# Altium schematic sheet 07-NCP3066_LCD背光.SchDoc
size A4; DocumentNumber: 28; SheetNumber: 28; SheetTotal: 29
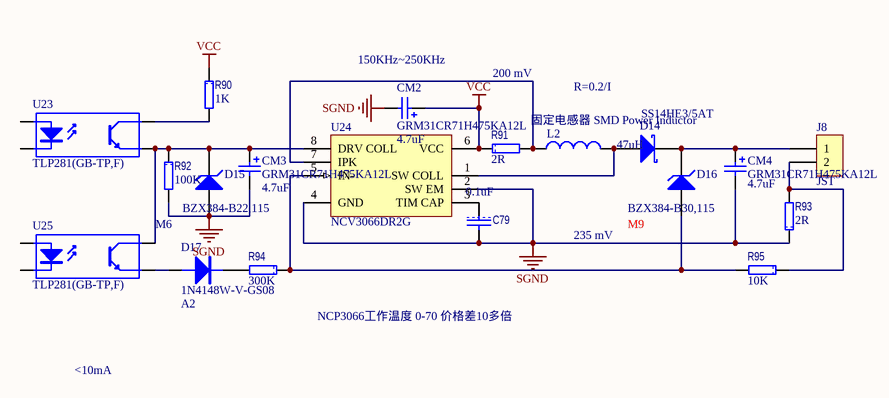
[diagram p0: 07-NCP3066_LCD背光.SchDoc]

## Parts
C79  value 0.1uF  [1608[0603]C]  (hidden comment: C1608X7R1H104K)
CM2  GRM31CR71H475KA12L  value 4.7uF  [3216[1206]C]
CM3  GRM31CR71H475KA12L  value 4.7uF  [3216[1206]C]
CM4  GRM31CR71H475KA12L  value 4.7uF  [3216[1206]C]
D14  SS14HE3/5AT  [DO-214AC/SMA]
D15  BZX384-B22,115  value M6  [SOD323]
D16  BZX384-B30,115  value M9  [SOD323]
D17  1N4148W-V-GS08  value A2  [SOD323]
J8  JST  [JST]
L2  value 47uH  [INDP5050X28N]  (hidden comment: CDRH5D28RH125NP-470MC)
R90  value 1K  [1608[0603]R]  (hidden comment: CRCW06031K00FKEA)
R91  value 2R  [1608[0603]R]  (hidden comment: CRCW06032R00FKEA)
R92  value 100K  [1608[0603]R]  (hidden comment: CRCW0603100KFKEA)
R93  value 2R  [1608[0603]R]  (hidden comment: CRCW06032R00FKEA)
R94  value 300K  [1608[0603]R]  (hidden comment: CRCW0603300KFKEA)
R95  value 10K  [1608[0603]R]  (hidden comment: CRCW060310K0FKEA)
U23  TLP281(GB-TP,F)  [SSOP4_N]
U24  NCV3066DR2G  [SOIC8_N]
U25  TLP281(GB-TP,F)  [SSOP4_N]

## Nets
SGND: C79.2 CM2.2 CM3.2 CM4.2 D15.1(A) R92.2 R93.1 U24.2(SW_EM) U24.4(GND)
VCC: CM2.1 R90.1 R91.1 U24.6(VCC)
NetC79_1: C79.1 U24.3(TIM_CAP)
NetCM3_1: CM3.1 D15.2(K) R92.1 U23.3(E) U24.8(DRV_COLL) U25.4(C)
NetCM4_1: CM4.1 D14.2(K) D16.2(K) J8.1
NetD14_1: D14.1(A) L2.2 U24.1(SW_COLL)
NetD16_1: D16.1(A) R94.1 R95.2 U24.5(IN-)
NetD17_1: D17.1(A) U25.3(E)
NetD17_2: D17.2(K) R94.2
NetJ8_2: J8.2 R93.2 R95.1
NetL2_1: L2.1 R91.2 U24.7(IPK)
NetR90_2: R90.2 U23.4(C)

Not connected (* = marked no-connect by the designer): U23 1(A) 2(K); U25 1(A) 2(K)

## Notes on the sheet
- (near CM2) 150KHz~250KHz
- 200 mV
- R=0.2/I
- 235 mV
- <10mA
- NCP3066工作温度 0-70 价格差10多倍

## Library data of the parts
C79 = CAP: 多层陶瓷电容器MLCC - SMD/SMT 0603 0.1uF 50volts X7R 10%; Manufacturer: TDK; 产品: General Type MLCCs; 产品种类: Low & Medium Capacitance SMD Ceramic Chip Capacitors; 外壳代码 - in: 0603; 外壳代码 - mm: 1608; 封装 / 箱体: 0603 (1608 metric); 封装: Reel; 尺寸: 0.8 mm W x 1.6 mm L x 0.8 mm H; 工作温度范围: - 55 C to + 125 C; 标准包装数量: 4000; 电压额定值: 50 V; 电容-nF: 100 nF; 电容-pF: 100000 pF; 系列: C; Category: 多层陶瓷电容器MLCC - SMD/SMT; ComponentLink1Description: http://www.tdk.com/pdf/general_B11.pdf; ComponentLink1URL: http://www.tdk.com/pdf/general_B11.pdf; Description 1: 多层陶瓷电容器MLCC - SMD/SMT 0603 0.1uF 50volts X7R 10%; Manufacturer Part Number: C1608X7R1H104K; Minimum Order Quantity: 1; Pricing 1: 1=0.160, 50=0.070, 100=0.036, 500=0.019, 1000=0.013, 4000=0.010, 8000=0.009, 12000=0.008, 20000=0.007 (USD); Reeling: True; RoHS - 贸泽: Y; RoHS: RoHS Compliant; Stock 1: 224604; Supplier 1: Mouser; Supplier Part Number 1: 810-C1608X7R1H104K; 制造商: TDK; 容差: 10 %; 温度系数/代码: X7R; 电容: 0.1 uF; 端接类型: SMD/SMT
CM2-CM4 = Cap Pol2: 多层陶瓷电容器MLCC - SMD/SMT 4.7uF 50Volts 10%; Manufacturer: Murata Electronics; 尺寸: 1.6 mm W x 3.2 mm L x 1.6 mm H; 工作温度范围: - 55 C to + 125 C; 封装 / 箱体: 1206 (3216 metric); 封装: Reel; 产品: General Type MLCCs; 系列: GRM; 电压额定值: 50 V; 电容-nF: 4700 nF; 外壳代码 - in: 1206; 外壳代码 - mm: 3216; 制造商: Murata; 标准包装数量: 2000; 温度系数/代码: X7R; Supplier 1: Mouser; Supplier Part Number 1: 81-GRM31CR71H475KA2L; Manufacturer Part Number: GRM31CR71H475KA12L; RoHS: RoHS Compliant; Description 1: 多层陶瓷电容器MLCC - SMD/SMT 4.7uF 50Volts 10%; Category: 多层陶瓷电容器MLCC - SMD/SMT; Stock 1: 57549; Pricing 1: 1=0.890, 10=0.561, 100=0.338, 1000=0.309, 2000=0.194, 10000=0.191, 24000=0.187, 50000=0.183 (USD); 电容: 4.7 uF; 端接类型: SMD/SMT; 容差: 10 %; RoHS - 贸泽: Y; Minimum Order Quantity: 1; Reeling: True; ComponentLink1URL: http://www.mouser.com/ds/2/281/product-244798.pdf; ComponentLink1Description: http://www.mouser.com/ds/2/281/product-244798.pdf
D14 = 10BQ060: 肖特基二极管与整流器 40 Volt 1.0 Amp 40 Amp IFSM; Manufacturer: Vishay Semiconductors; 配置: Single; 工作温度范围: - 65 C to + 125 C; 封装 / 箱体: SMA (DO-214AC); 封装: Reel; 产品: Schottky Rectifiers; 正向连续电流: 1 A; 最大浪涌电流: 40 A; 安装风格: SMD/SMT; 正向电压下降: 0.5 V; 制造商: Vishay; 最大反向漏泄电流: 200 uA; 峰值反向电压: 40 V; 标准包装数量: 7500; Supplier 1: Mouser; Supplier Part Number 1: 625-SS14HE3/5AT; Manufacturer Part Number: SS14HE3/5AT; RoHS: RoHS Compliant By Exemption; Description 1: 肖特基二极管与整流器 40 Volt 1.0 Amp 40 Amp IFSM; Category: 肖特基二极管与整流器; Stock 1: 0; Pricing 1: 1=0.160, 10=0.157, 50=0.153, 100=0.147, 750=0.126, 1500=0.105, 3000=0.081, 7500=0.069, 12000=0.066 (USD); 产品种类: Schottky Rectifiers; RoHS - 贸泽: E; Minimum Order Quantity: 1; Reeling: True; ComponentLink1URL: http://www.mouser.com/ds/2/427/ss12-100300.pdf; ComponentLink1Description: http://www.mouser.com/ds/2/427/ss12-100300.pdf
D15 = D Zener: 稳压二极管 DIODE ZENER 2 PCT; Manufacturer: NXP Semiconductors; 配置: Single; 封装 / 箱体: SC-76; 封装: Reel; 安装风格: SMD/SMT; 功率耗散: 300 mW; 正向电压下降: 1.1 V at 100 mA; 制造商: NXP; 最大工作温度: + 150 C; 最大反向漏泄电流: 0.05 uA; 最大齐纳阻抗: 55 Ohms; 最小工作温度: - 65 C; 产品种类: Diodes - Zener; 标准包装数量: 3000; 电压温度系数: 18.4 mV/k; 电压容差: 2 %; 齐纳电压: 22 V; Supplier 1: Mouser; Supplier Part Number 1: 771-BZX384-B22115; Manufacturer Part Number: BZX384-B22,115; RoHS: RoHS Compliant; Description 1: 稳压二极管 DIODE ZENER 2 PCT; Category: 稳压二极管; Stock 1: 5; Pricing 1: 1=0.290, 25=0.209, 100=0.163, 250=0.102, 500=0.087, 1000=0.059, 3000=0.052, 6000=0.045, 12000=0.039 (USD); RoHS - 贸泽: Y; Minimum Order Quantity: 1; Reeling: True; ComponentLink1URL: http://www.mouser.com/ds/2/302/BZX384_SERIES_2-80586.pdf; ComponentLink1Description: http://www.mouser.com/ds/2/302/BZX384_SERIES_2-80586.pdf
D16 = D Zener: 稳压二极管 DIODE ZENER 2 PCT; Manufacturer: NXP Semiconductors; 配置: Single; 封装 / 箱体: SC-76; 封装: Reel; 安装风格: SMD/SMT; 功率耗散: 300 mW; 齐纳电流: 200 mA; 制造商: NXP; 最大工作温度: + 150 C; 最大反向漏泄电流: 50 nA; 最大齐纳阻抗: 80 Ohms; 最小工作温度: - 65 C; 产品种类: Diodes - Zener; 标准包装数量: 3000; 电压温度系数: 26.6 mV/k; 电压容差: 2 %; 齐纳电压: 30 V; Supplier 1: Mouser; Supplier Part Number 1: 771-BZX384-B30115; Manufacturer Part Number: BZX384-B30,115; RoHS: RoHS Compliant; Description 1: 稳压二极管 DIODE ZENER 2 PCT; Category: 稳压二极管; Stock 1: 13413; Pricing 1: 1=0.260, 25=0.190, 100=0.147, 250=0.093, 500=0.079, 1000=0.054, 3000=0.047, 6000=0.041, 12000=0.035 (USD); RoHS - 贸泽: Y; Minimum Order Quantity: 1; Reeling: True; ComponentLink1URL: http://www.mouser.com/ds/2/302/BZX384_SERIES_2-80586.pdf; ComponentLink1Description: http://www.mouser.com/ds/2/302/BZX384_SERIES_2-80586.pdf
D17 = 1N4148W: 二极管 - 通用，功率，开关 100V Io/150mA; Manufacturer: Vishay Semiconductors; 配置: Single; 工作温度范围: - 65 C to + 150 C; 封装 / 箱体: SOD-123; 封装: Reel; 产品: Switching Diodes; 正向连续电流: 0.15 A; 最大浪涌电流: 0.5 A; 安装风格: SMD/SMT; 恢复时间: 4 ns; 正向电压下降: 1.2 V; 制造商: Vishay; 最大二极管电容: 4 pF; 最大工作温度: + 150 C; 最大功率耗散: 350 mW; 最大反向漏泄电流: 5 uA; 最小工作温度: - 65 C; 标准包装数量: 15000; Supplier 1: Mouser; Supplier Part Number 1: 625-1N4148W-V; Manufacturer Part Number: 1N4148W-V-GS08; RoHS: RoHS Compliant; Category: 二极管 - 通用，功率，开关; Stock 1: 404148; Pricing 1: 1=0.090, 10=0.083, 50=0.072, 100=0.068, 500=0.032, 1000=0.026, 3000=0.021, 9000=0.016, 10000=0.016, 18000=0.014 (USD); 峰值反向电压: 100 V; 产品种类: Switching Diodes; RoHS - 贸泽: Y; Minimum Order Quantity: 1; Reeling: True; ComponentLink1URL: http://www.mouser.com/ds/2/427/1n4148w--240387.pdf; ComponentLink1Description: http://www.mouser.com/ds/2/427/1n4148w--240387.pdf; Description 1: 二极管 - 通用，功率，开关 100V Io/150mA
J8 = CON2: CON
L2 = Inductor: 固定电感器 SMD Power Inductor; Manufacturer: Sumida; 尺寸: 6.2 mm W x 6.3 mm L x 3 mm H; 电感: 47 uH; 最大直流电流: 0.91 A; 最大直流电阻: 500 mOhms; 工作温度范围: - 40 C to + 125 C; 封装: Reel; 产品: SMD Power Inductors; 系列: CDRH; 屏蔽: Shielded; 端接类型: SMD/SMT; 容差: 20 %; 外壳高度: 3 mm; 外壳长度: 6.3 mm; 外壳宽度: 6.2 mm; Product Status: New Product; Supplier 1: Mouser; Supplier Part Number 1: 851-CDRH5D28RH125470; Manufacturer Part Number: CDRH5D28RH125NP-470MC; RoHS: RoHS Compliant; Description 1: 固定电感器 SMD Power Inductor; Category: 固定电感器; Stock 1: 3441; Pricing 1: 1=0.950, 10=0.920, 100=0.650, 500=0.640, 1000=0.620, 2000=0.600, 4000=0.470 (USD); 制造商: Sumida; RoHS - 贸泽: Y; Minimum Order Quantity: 1; Reeling: True; ComponentLink1URL: http://www.mouser.com/ds/2/390/CDRH5D28RH125-4194.pdf; ComponentLink1Description: http://www.mouser.com/ds/2/390/CDRH5D28RH125-4194.pdf
R90 = RES: 厚膜电阻器 - SMD 1/10watt 1.0Kohms 1%; Manufacturer: Vishay / Dale; 尺寸: 0.85 mm W x 1.55 mm L x 0.45 mm H; 工作温度范围: - 55 C to + 155 C; 封装 / 箱体: 0603 (1608 metric); 封装: Reel; 功率额定值: 100 mW; 产品: Thick Film Resistors SMD; 电阻: 1 kOhms; 系列: CRCW; 温度系数: 100 PPM / K; 端接类型: SMD/SMT; 电压额定值: 75 V; 制造商: Vishay; 产品种类: 0603 Thick Film Chip Resistors; 标准包装数量: 5000; 外壳代码 - in: 0603; 外壳代码 - mm: 1608; Supplier 1: Mouser; Supplier Part Number 1: 71-CRCW0603-1.0K-E3; Manufacturer Part Number: CRCW06031K00FKEA; RoHS: RoHS Compliant By Exemption; Category: 厚膜电阻器 - SMD; Stock 1: 276938; Pricing 1: 1=0.080, 10=0.013, 100=0.010, 1000=0.008, 5000=0.005, 25000=0.004, 50000=0.003 (USD); 容差: 1 %; RoHS - 贸泽: E; Minimum Order Quantity: 1; Reeling: True; ComponentLink1URL: http://www.mouser.com/ds/2/427/dcrcwe3-109170.pdf; ComponentLink1Description: http://www.mouser.com/ds/2/427/dcrcwe3-109170.pdf; Description 1: 厚膜电阻器 - SMD 1/10watt 1.0Kohms 1%
R91 R93 = RES: 厚膜电阻器 - SMD 1/10watt 2ohms 1%; Manufacturer: Vishay / Dale; 尺寸: 0.85 mm W x 1.55 mm L x 0.45 mm H; 工作温度范围: - 55 C to + 155 C; 封装 / 箱体: 0603 (1608 metric); 封装: Reel; 功率额定值: 100 mW; 产品: Thick Film Resistors SMD; 系列: CRCW; 温度系数: 100 PPM / K; 端接类型: SMD/SMT; 电压额定值: 75 V; 外壳代码 - in: 0603; 外壳代码 - mm: 1608; 制造商: Vishay; 产品种类: 0603 Thick Film Chip Resistors; Product Status: New at Mouser; Supplier 1: Mouser; Supplier Part Number 1: 71-CRCW06032R00FKEA; Manufacturer Part Number: CRCW06032R00FKEA; RoHS: RoHS Compliant By Exemption; Category: 厚膜电阻器 - SMD; Stock 1: 9213; Pricing 1: 1=0.080, 10=0.013, 100=0.010, 1000=0.008, 5000=0.005, 25000=0.004, 50000=0.003 (USD); 电阻: 2 Ohms; 容差: 1 %; RoHS - 贸泽: E; Minimum Order Quantity: 1; Reeling: True; ComponentLink1URL: http://www.mouser.com/ds/2/427/dcrcwe3-109170.pdf; ComponentLink1Description: http://www.mouser.com/ds/2/427/dcrcwe3-109170.pdf; Description 1: 厚膜电阻器 - SMD 1/10watt 2ohms 1%
R92 = RES: 厚膜电阻器 - SMD 1/10watt 100Kohms 1%; Manufacturer: Vishay / Dale; 尺寸: 0.85 mm W x 1.55 mm L x 0.45 mm H; 工作温度范围: - 55 C to + 155 C; 封装 / 箱体: 0603 (1608 metric); 封装: Reel; 功率额定值: 100 mW; 产品: Thick Film Resistors SMD; 系列: CRCW; 温度系数: 100 PPM / K; 端接类型: SMD/SMT; 电压额定值: 75 V; 制造商: Vishay; 产品种类: 0603 Thick Film Chip Resistors; 标准包装数量: 5000; 外壳代码 - in: 0603; 外壳代码 - mm: 1608; Supplier 1: Mouser; Supplier Part Number 1: 71-CRCW0603-100K-E3; Manufacturer Part Number: CRCW0603100KFKEA; RoHS: RoHS Compliant By Exemption; Category: 厚膜电阻器 - SMD; Stock 1: 175756; Pricing 1: 1=0.080, 10=0.013, 100=0.010, 1000=0.008, 5000=0.005, 25000=0.004, 50000=0.003 (USD); 电阻: 100 kOhms; 容差: 1 %; RoHS - 贸泽: E; Minimum Order Quantity: 1; Reeling: True; ComponentLink1URL: http://www.mouser.com/ds/2/427/dcrcwe3-109170.pdf; ComponentLink1Description: http://www.mouser.com/ds/2/427/dcrcwe3-109170.pdf; Description 1: 厚膜电阻器 - SMD 1/10watt 100Kohms 1%
R94 = RES: 厚膜电阻器 - SMD 1/10watt 300Kohms 1%; Manufacturer: Vishay / Dale; 尺寸: 0.85 mm W x 1.55 mm L x 0.45 mm H; 工作温度范围: - 55 C to + 155 C; 封装 / 箱体: 0603 (1608 metric); 封装: Reel; 功率额定值: 100 mW; 产品: Thick Film Resistors SMD; 系列: CRCW; 温度系数: 100 PPM / K; 端接类型: SMD/SMT; 电压额定值: 75 V; 外壳代码 - in: 0603; 外壳代码 - mm: 1608; 制造商: Vishay; 产品种类: 0603 Thick Film Chip Resistors; 标准包装数量: 5000; Supplier 1: Mouser; Supplier Part Number 1: 71-CRCW0603-300K-E3; Manufacturer Part Number: CRCW0603300KFKEA; RoHS: RoHS Compliant By Exemption; Category: 厚膜电阻器 - SMD; Stock 1: 19604; Pricing 1: 1=0.080, 10=0.013, 100=0.010, 1000=0.008, 5000=0.005, 25000=0.004, 50000=0.003 (USD); 电阻: 300 kOhms; 容差: 1 %; RoHS - 贸泽: E; Minimum Order Quantity: 1; Reeling: True; ComponentLink1URL: http://www.mouser.com/ds/2/427/dcrcwe3-109170.pdf; ComponentLink1Description: http://www.mouser.com/ds/2/427/dcrcwe3-109170.pdf; Description 1: 厚膜电阻器 - SMD 1/10watt 300Kohms 1%
R95 = RES: 厚膜电阻器 - SMD 1/10watt 10Kohms 1%; Manufacturer: Vishay / Dale; 尺寸: 0.85 mm W x 1.55 mm L x 0.45 mm H; 工作温度范围: - 55 C to + 155 C; 封装 / 箱体: 0603 (1608 metric); 封装: Reel; 功率额定值: 100 mW; 产品: Thick Film Resistors SMD; 系列: CRCW; 温度系数: 100 PPM / K; 端接类型: SMD/SMT; 电压额定值: 75 V; 制造商: Vishay; 产品种类: 0603 Thick Film Chip Resistors; 标准包装数量: 5000; 外壳代码 - in: 0603; 外壳代码 - mm: 1608; Supplier 1: Mouser; Supplier Part Number 1: 71-CRCW0603-10K-E3; Manufacturer Part Number: CRCW060310K0FKEA; RoHS: RoHS Compliant By Exemption; Category: 厚膜电阻器 - SMD; Stock 1: 0; Pricing 1: 1=0.080, 10=0.013, 100=0.010, 1000=0.008, 5000=0.005, 25000=0.004, 50000=0.003 (USD); 电阻: 10 kOhms; 容差: 1 %; RoHS - 贸泽: E; Minimum Order Quantity: 1; Reeling: True; ComponentLink1URL: http://www.mouser.com/ds/2/427/dcrcwe3-109170.pdf; ComponentLink1Description: http://www.mouser.com/ds/2/427/dcrcwe3-109170.pdf; Description 1: 厚膜电阻器 - SMD 1/10watt 10Kohms 1%
U23 U25 = Optoisolator1: 晶体管输出光电耦合器 80Vceo 2500Vrms standard; Manufacturer: Toshiba; 输出设备: NPN Phototransistor; 输出类型: DC; 封装 / 箱体: SOP-4; 封装: Reel; 电流传递比: 600 %; 最大集电极电流: 50 mA; 最大集电极/发射极饱和电压: 0.4 V; 最大集电极/发射极电压: 80 V; 最大下降时间: 3 us; 最大正向二极管电压: 1.3 V; 最大工作温度: + 100 C; 最大功率耗散: 200 mW; 最大反向二极管电压: 5 V; 最大上升时间: 2 us; 最小工作温度: - 55 C; 每芯片的通道数量: 1 Channel; 产品种类: Opto - Photocouplers; 标准包装数量: 2500; Product Status: End of Life; Supplier 1: Mouser; Supplier Part Number 1: 757-TLP281(GB-TP,F); Manufacturer Part Number: TLP281(GB-TP,F); RoHS: RoHS Compliant; Description 1: 晶体管输出光电耦合器 80Vceo 2500Vrms standard; Category: 晶体管输出光电耦合器; Stock 1: 56577; Pricing 1: 1=0.810, 10=0.636, 100=0.412, 1000=0.330, 2500=0.270, 10000=0.259, 25000=0.250 (USD); 绝缘电压: 2500 Vrms; 制造商: Toshiba; 最大输入二极管电流: 50 mA; RoHS - 贸泽: Y; Minimum Order Quantity: 1; Reeling: True; ComponentLink1URL: http://www.mouser.com/ds/2/408/4195-37827.pdf; ComponentLink1Description: http://www.mouser.com/ds/2/408/4195-37827.pdf
U24 = MC33063AD: IC LED DRIVER HIGH BRIGHT 8-SOIC; Manufacturer: ON Semiconductor; Constant Current: Yes; Topology: PWM, Step-Down (Buck), Step-Up (Boost); Number of Outputs: 1; Type - Primary: Automotive; Type - Secondary: High Brightness LED (HBLED); Frequency: 100kHz ~ 250kHz; Voltage - Supply: 3 V ~ 40 V; Supplier 1: Digi-Key; Supplier Part Number 1: NCV3066DR2G-ND; Manufacturer Part Number: NCV3066DR2G; RoHS: RoHS Compliant; Description 1: IC LED DRIVER HIGH BRIGHT 8-SOIC; Category: Integrated Circuits (ICs); Stock 1: 0; Pricing 1: 2500=0.675 (USD); Packaging: Tape & Reel (TR); Constant Voltage: -; Internal Driver: Yes; Voltage - Output: -; Mounting Type: Surface Mount; Package / Case: 8-SOIC (0.154", 3.90mm Width); Supplier Device Package: 8-SOIC N; Operating Temperature: -40°C ~ 125°C; ComponentLink1URL: http://www.onsemi.com/pub_link/Collateral/NCP3066-D.PDF; ComponentLink1Description: http://www.onsemi.com/pub_link/Collateral/NCP3066-D.PDF